# EAGLE design 009 (EAGLE 5.09)
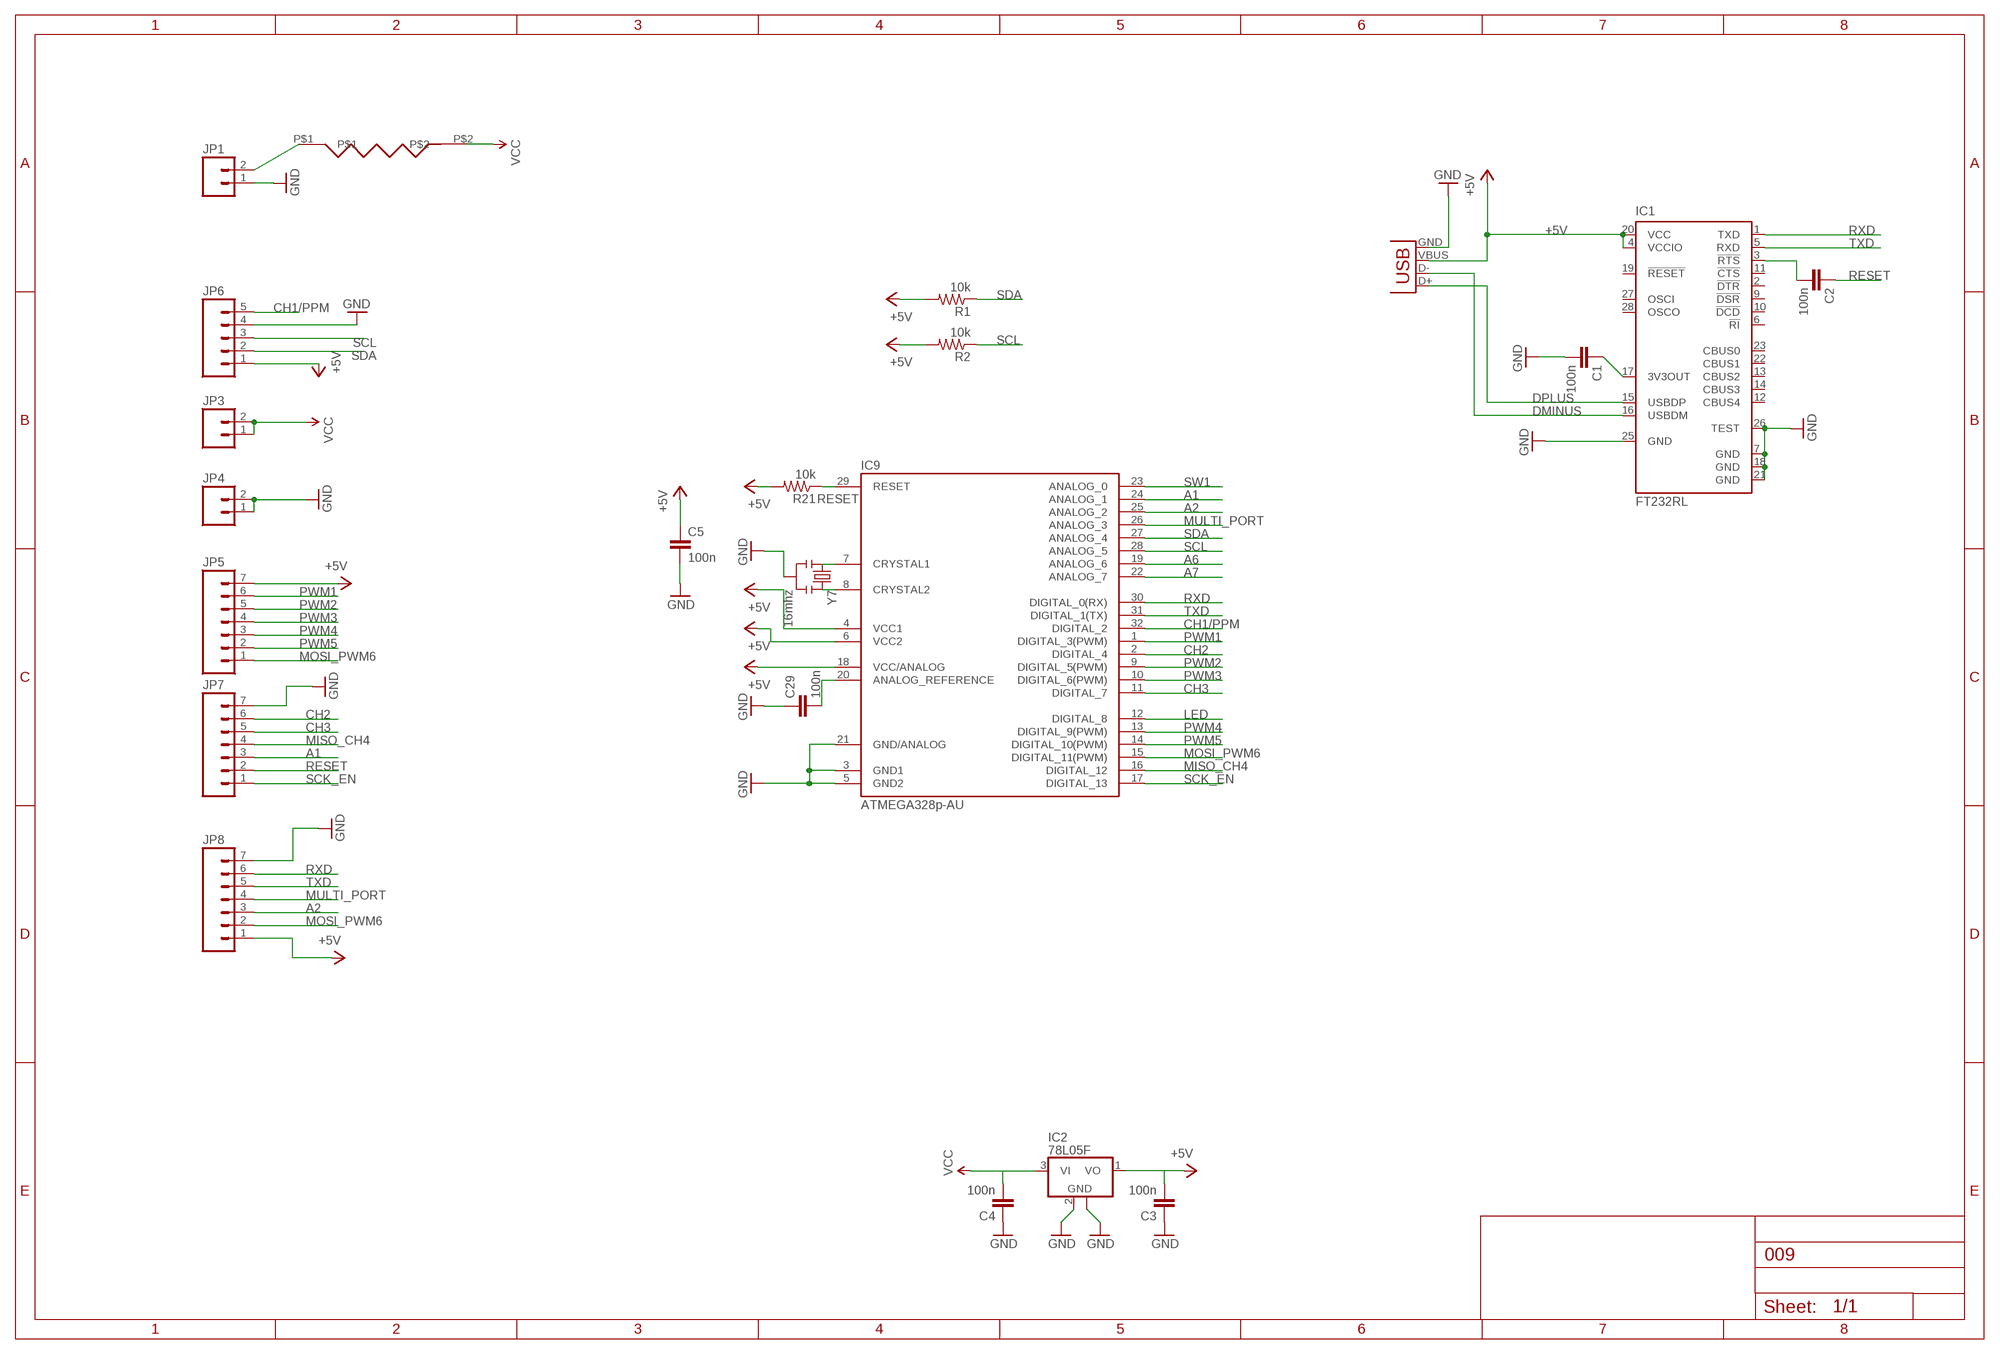
[diagram p0: schematic, sheet 1]

## Parts
C1  100n  CAP0805  [0805]
C2  100n  CAP0805  [0805]
C3  100n  CAP0805  [0805]
C4  100n  CAP0805  [0805]
C5  100n  CAP0805  [0805]
C29  100n  CAP0805  [0805]
IC1  FT232RL  [SSOP28]
IC2  78L05F  [SOT89]
IC9  ATMEGA328p-AU  ATMEGA168-AU  [TQFP32-08]
JP1  M02PTH  [1X02]
JP3  M02PTH  [1X02]
JP4  M02PTH  [1X02]
JP5  M07  [1X07]
JP6  M05PTH  [1X05]
JP7  M07  [1X07]
JP8  M07  [1X07]
R1  10k  RESISTOR0805-RES  [0805]
R2  10k  RESISTOR0805-RES  [0805]
R21  10k  RESISTOR0805-RES  [0805]
U$1  SMD_FUSE  [SMD_FUSE]
X2  USBOLD  [USB-MINIB-OLD]
Y7  16mhz  RESONATORSMD  [RESONATOR-SMD]

## Nets
+5V: C3.2 C5.1 IC1.4(VCCIO) IC1.20(VCC) IC2.1(VO) IC9.4(VCC1) IC9.6(VCC2) IC9.18(VCC/ANALOG) JP5.7 JP6.1 JP8.1 R1.2 R2.2 R21.2 X2.VBUS
A1: IC9.24(ANALOG_1) JP7.3
A2: IC9.25(ANALOG_2) JP8.3
A6: IC9.19(ANALOG_6)
A7: IC9.22(ANALOG_7)
CH1/PPM: IC9.32(DIGITAL_2) JP6.5
CH2: IC9.2(DIGITAL_4) JP7.6
CH3: IC9.11(DIGITAL_7) JP7.5
DMINUS: IC1.16(USBDM) X2.D-
DPLUS: IC1.15(USBDP) X2.D+
GND: C1.2 C3.1 C4.1 C5.2 C29.1 IC1.7(GND) IC1.18(GND) IC1.21(GND) IC1.25(GND) IC1.26(TEST) IC2.2(GND) IC2.2@1(GND) IC9.3(GND1) IC9.5(GND2) IC9.21(GND/ANALOG) JP1.1 JP4.1 JP4.2 JP6.4 JP7.7 JP8.7 X2.GND Y7.2
LED: IC9.12(DIGITAL_8)
MISO_CH4: IC9.16(DIGITAL_12) JP7.4
MOSI_PWM6: IC9.15(DIGITAL_11(PWM)) JP5.1 JP8.2
MULTI_PORT: IC9.26(ANALOG_3) JP8.4
N$1: JP1.2 U$1.P$1
N$22: C1.1 IC1.17(3V3OUT)
N$26: C2.2 IC1.3(!RTS)
N$38: IC9.8(CRYSTAL2) Y7.3
N$39: IC9.7(CRYSTAL1) Y7.1
N$40: C29.2 IC9.20(ANALOG_REFERENCE)
PWM1: IC9.1(DIGITAL_3(PWM)) JP5.6
PWM2: IC9.9(DIGITAL_5(PWM)) JP5.5
PWM3: IC9.10(DIGITAL_6(PWM)) JP5.4
PWM4: IC9.13(DIGITAL_9(PWM)) JP5.3
PWM5: IC9.14(DIGITAL_10(PWM)) JP5.2
RESET: C2.1 IC9.29(RESET) JP7.2 R21.1
RXD: IC1.1(TXD) IC9.30(DIGITAL_0(RX)) JP8.6
SCK_EN: IC9.17(DIGITAL_13) JP7.1
SCL: IC9.28(ANALOG_5) JP6.3 R2.1
SDA: IC9.27(ANALOG_4) JP6.2 R1.1
SW1: IC9.23(ANALOG_0)
TXD: IC1.5(RXD) IC9.31(DIGITAL_1(TX)) JP8.5
VCC: C4.2 IC2.3(VI) JP3.1 JP3.2 U$1.P$2
Unconnected: IC1.2(!DTR) IC1.6(!RI) IC1.9(!DSR) IC1.10(!DCD) IC1.11(!CTS) IC1.12(CBUS4) IC1.13(CBUS2) IC1.14(CBUS3) IC1.19(!RESET) IC1.22(CBUS1) IC1.23(CBUS0) IC1.27(OSCI) IC1.28(OSCO)

## Notes on the sheet
- FTDI

## Library data of the parts
C1-C5 C29 = SparkFun:CAP: Capacitor Standard 0603 ceramic capacitor, and 0.1" leaded capacitor.
IC1 = ftdichip:FT232R: Source: http://www.ftdichip.com/Documents/DataSheets/DS_FT232R_v104.pdf
IC2 = linear:78L*: POSITOIV-VOLTAGE REGULATORS Output up to 100 mA Source: http://focus.ti.com/lit/ds/symlink/ua78l05.pdf
IC9 = Arduino-AVR:ATMEGA168
JP1 JP3 JP4 = SparkFun:M02: Header 2 Standard 2-pin 0.1" header. Use with straight break away headers (SKU : PRT-00116), right angle break away headers (PRT-00553), swiss pins (PRT-00743), machine pins (PRT-00117), and female headers (PRT-00115). Molex polarized connector foot print use with SKU : PRT-08233 with associated crimp pins and housings.
JP5 JP7 JP8 = SparkFun:M07: Header 7 Standard 7-pin 0.1" header. Use with straight break away headers (SKU : PRT-00116), right angle break away headers (PRT-00553), swiss pins (PRT-00743), machine pins (PRT-00117), and female headers (PRT-00115). NOTES ON THE VARIANTS LOCK and LOCK_LONGPADS... This footprint was designed to help hold the alignment of a through-hole component (i.e. 7-pin header) while soldering it into place. You may notice that each hole has been shifted either up or down by 0.005 of an inch from it's more standard position (which is usually a perfectly straight line). This slight alteration caused the pins (the squares in the middle) to touch the edges of the holes. Because they are alternating, it causes a "brace" to hold the header in place. 0.005 has proven to be the perfect amount of "off-center" position when using our standard breakaway headers. Although looks a little odd when you look at the bare footprint, once you have a header in there, the alteration is very hard to notice. Also, if you push a header all the way into place, it is covered up entirely on the bottom side. This idea of altering the position of holes to aid alignment will be further integrated into the Sparkfun Library for other footprints. It can help hold any component with 3 or more connection pins.
JP6 = SparkFun:M05: Header 5 Standard 5-pin 0.1" header. Use with straight break away headers (SKU : PRT-00116), right angle break away headers (PRT-00553), swiss pins (PRT-00743), machine pins (PRT-00117), and female headers (PRT-00115). Molex polarized connector foot print use with SKU : PRT-08230 with associated crimp pins and housings.
R1 R2 R21 = SparkFun:RESISTOR: Resistor Basic schematic elements and footprints for 0603, 1206, and PTH resistors.
U$1 = SMD_FUSE:SMD_FUSE
X2 = SparkFun:USB: USB Connectors USB-B-PTH is fully proven SKU : PRT-00139 USB-miniB is fully proven SKU : PRT-00587 USB-A-PCB is untested. USB-A-H is throughly reviewed, but untested. Spark Fun Electronics SKU : PRT-00437 USB-B-SMT is throughly reviewed, but untested. Needs silkscreen touching up. USB-A-S has not been used/tested USB-MB-H has not been used/tested
Y7 = SparkFun:RESONATOR: Resonator Small SMD resonator. This is the itty bitty 10/20MHz resonators with built in caps. CSTCE10M0G55 and CSTCE20M0V53. Footprint has been reviewed closely but hasn't been tested yet.

## Net classes
0 default: width 0.152 mm, clearance 0.152 mm

## Board
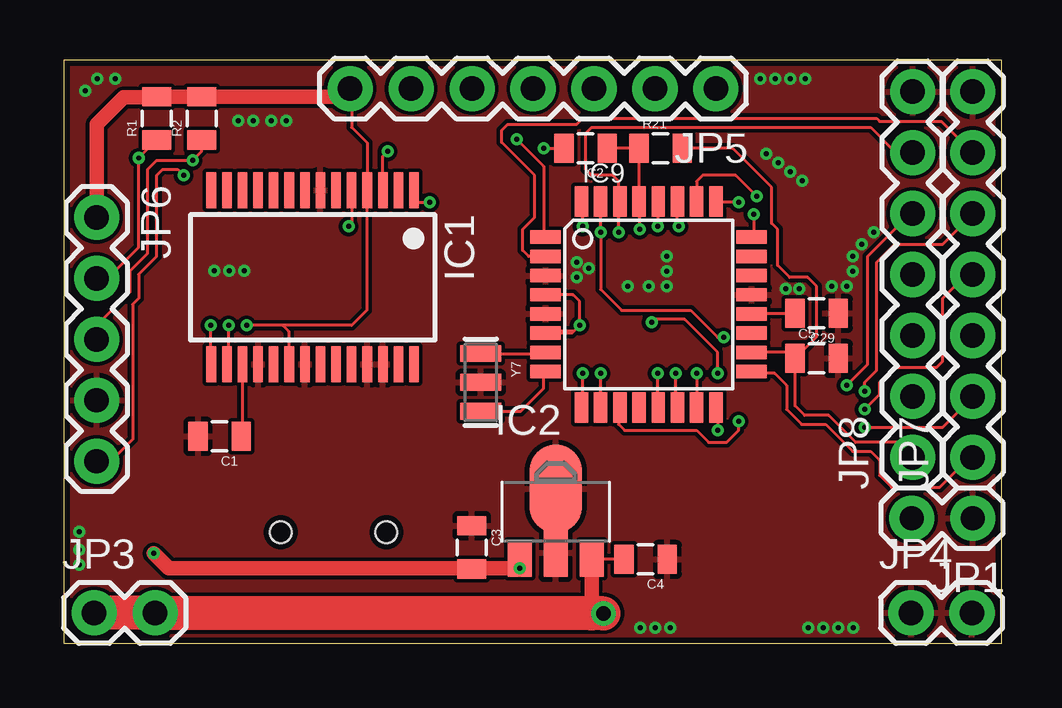
[diagram p1: board, top side]
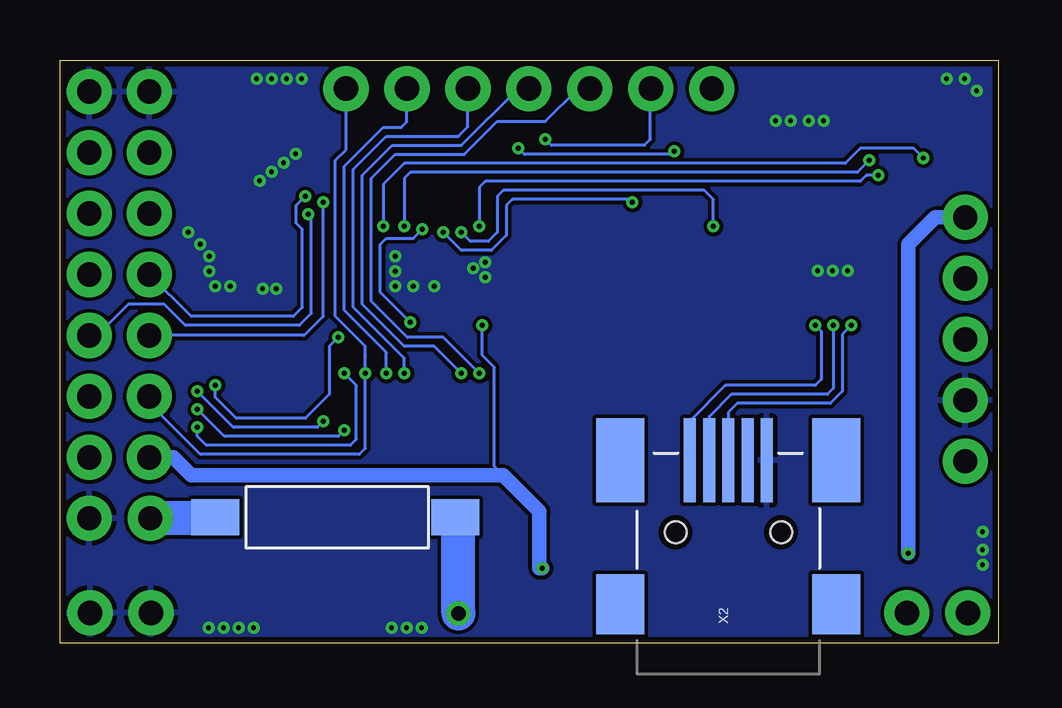
[diagram p2: board, bottom side, seen from below]

Size 39.1 x 24.31 mm. Coordinates in mm from the lower left corner, seen from the top.
Outline: 0,0 39.1,0 39.1,24.31 0,24.31 0,0
Copper layers (1*16): Top 0.035mm / dielectric 1.5mm / Bottom 0.035mm
Design rules "mydefaults": minimum track width 6mil, minimum drill 12mil, track to track 6mil, track to pad 6mil, pad to pad 6mil, via to via 6mil, smd to smd 0mil, copper to edge 10mil, drill to drill 8mil, minimum pad ring 8mil, minimum via ring 6mil, stop-mask expansion 2mil, vias tented up to drill 40mil, thermal gap 8mil

### Footprints (pad centres in the part's own frame; a part is rotated, then mirrored left to right if it is on the bottom)
0805 = smd 0.8 x 1.2: 1 -0.9,0; 2 0.9,0
SSOP28 = smd 0.4 x 1.5: 1 -4.225,-3.625; 2 -3.575,-3.625; 3 -2.925,-3.625; 4 -2.275,-3.625; 5 -1.625,-3.625; 6 -0.975,-3.625; 7 -0.325,-3.625; 8 0.325,-3.625; 9 0.975,-3.625; 10 1.625,-3.625; 11 2.275,-3.625; 12 2.925,-3.625; 13 3.575,-3.625; 14 4.225,-3.625; 15 4.225,3.625; 16 3.575,3.625; 17 2.925,3.625; 18 2.275,3.625; 19 1.625,3.625; 20 0.975,3.625; 21 0.325,3.625; 22 -0.325,3.625; 23 -0.975,3.625; 24 -1.625,3.625; 25 -2.275,3.625; 26 -2.925,3.625; 27 -3.575,3.625; 28 -4.225,3.625
SOT89 = smd 1 x 1.5: 1 -1.499,-1.981; 3 1.499,-1.981 | smd 1 x 2: 2 0,-1.727 | smd 2.2 x 3.7: 2@1 0,0.94
TQFP32-08 = smd 1.27 x 0.559: 1 -4.293,2.8; 2 -4.293,2; 3 -4.293,1.2; 4 -4.293,0.4; 5 -4.293,-0.4; 6 -4.293,-1.2; 7 -4.293,-2; 8 -4.293,-2.8; 17 4.293,-2.8; 18 4.293,-2; 19 4.293,-1.2; 20 4.293,-0.4; 21 4.293,0.4; 22 4.293,1.2; 23 4.293,2; 24 4.293,2.8 | smd 0.559 x 1.27: 9 -2.8,-4.293; 10 -2,-4.293; 11 -1.2,-4.293; 12 -0.4,-4.293; 13 0.4,-4.293; 14 1.2,-4.293; 15 2,-4.293; 16 2.8,-4.293; 25 2.8,4.293; 26 2,4.293; 27 1.2,4.293; 28 0.4,4.293; 29 -0.4,4.293; 30 -1.2,4.293; 31 -2,4.293; 32 -2.8,4.293
1X02 = drill 1.016 pad 1.88 round: 1 0,0; 2 2.54,0
1X07 = drill 1.016 pad 1.88 round: 1 0,0; 2 2.54,0; 3 5.08,0; 4 7.62,0; 5 10.16,0; 6 12.7,0; 7 15.24,0
1X05 = drill 1.016 pad 1.88 round: 1 0,0; 2 2.54,0; 3 5.08,0; 4 7.62,0; 5 10.16,0
SMD_FUSE = smd 2 x 1.5: P$1 0,0; P$2 10,0
USB-MINIB-OLD = smd 2.5 x 2: 1 -3,-4.5; 2 -3,4.5 | smd 3.5 x 2: 3 3,-4.5; 4 3,4.5 | smd 3.5 x 0.5: D+ 3,0; D- 3,0.8; GND 3,-1.6; ID 3,-0.8; VBUS 3.01,1.61 | hole 0.9: 0,2.2; 0,-2.2
RESONATOR-SMD = smd 0.7 x 1.7: 1 -1.2,0; 2 0,0; 3 1.2,0

### Placement (x,y rotation side)
C1  6.5,8.62 180 top
C2  21.75,20.62 180 top
C3  17,4 270 top
C4  24.25,3.5 180 top
C5  31.38,11.88 0 top
C29  31.38,13.75 180 top
IC1  10.38,15.25 180 top
IC2  20.5,5.5 0 top
IC9  24.38,14.12 0 top
JP1  37.88,5.21 180 top
JP3  1.27,1.27 0 top
JP4  35.31,1.27 0 top
JP5  27.18,23.11 180 top
JP6  1.38,17.75 270 top
JP7  37.88,7.75 90 top
JP8  35.38,7.75 90 top
R1  3.88,21.88 90 top
R2  5.75,21.88 90 top
R21  24.88,20.62 0 top
U$1  32.62,5.25 0 bottom
X2  11.25,4.62 90 bottom
Y7  17.38,10.88 270 top

### Tracks (layer width: path | path; a pad name or v marks a point on that pad's centre or on a via)
+5V  (via drill 0.2, 0.2 pad 0.12)
  Top 0.125: IC2.1 18.98,3.5 | 9.12,13.25 v7.62,13.25 | 9.12,13.25 9.38,13 9.38,11.65 IC1.20 | 9.12,13.25 12,13.25 12.62,13.88 12.62,18.85 IC1.4 12.65,20.85 12,21.5 12,23.05 JP5.7 | IC9.18 30.23,12.12 C5.1 | C5.1 30.48,9.9 30.88,9.5 31.88,9.5 33,8.38 34.75,8.38 JP8.1 | IC9.4 21.23,14.53 21.5,14.25 v21.5,13.25 21.25,13 | 21.25,13 20.16,13 IC9.6 21.18,12.93 21.25,13 | R21.2 27.88,20.62 29.5,19 29.5,17.5 29.75,17.25 29.75,15.75 30.25,15.25 31,15.25 31.38,14.88 31.38,12.78 C5.1
  Top 0.61: JP6.1 1.38,21.62 2.5,22.75 3.85,22.75 R2.2 R1.2 11.6,22.77 JP5.7 | 18.98,3.5 18.98,3.23 18.88,3.12 18.75,3.12 | 17.02,3.12 18.75,3.12 | 17.02,3.12 C3.2 | 18.75,3.12 19,3.38 IC2.1 v19,3.12 | 17.02,3.12 4.38,3.12 v3.75,3.75
  Bottom 0.125: X2.VBUS 12.86,9.27 11.38,10.75 7.62,10.75 7.38,11 7.38,13 v7.62,13.25 | v21.5,13.25 21.5,12 21,11.5 21,7.38 20.62,7
  Bottom 0.61: v3.75,3.75 3.75,16.62 2.62,17.75 JP6.1 | JP8.1 34.38,7.75 33.62,7 20.62,7 19.12,5.5 19.12,3.12 v19,3.12
A1  (via drill 0.2 pad 0.12)
  Top 0.125: v28.75,17.88 28.75,17.01 IC9.24
  Bottom 0.125: JP7.3 37.55,12.83 36.25,14.12 34.75,14.12 33.88,13.25 29.12,13.25 28.62,13.75 28.62,17.75 v28.75,17.88
A2  (via drill 0.2 pad 0.12)
  Top 0.125: v28.12,18.38 27.22,18.38 IC9.25
  Bottom 0.125: JP8.3 28.92,12.83 28.12,13.62 v28.12,18.38
CH1/PPM  (via drill 0.2)
  Top 0.125: JP6.5 1.96,7.59 2.88,8.5 2.88,14.12 3.12,14.38 3.12,15.38 3.88,16.12 3.88,19.5 4.12,19.75 4.75,19.75 v5,19.5 | v21.62,17.38 21.62,18.37 IC9.32
  Bottom 0.125: v5,19.5 5.5,19.5 5.75,19.25 21.38,19.25 21.62,19 v21.62,17.38
CH2
  Top 0.125: JP7.6 36.58,21.75 34,21.75 33.88,21.88 21.62,21.88 21.38,21.62 18.5,21.62 18.25,21.38 18.25,20.88 19.62,19.5 19.62,17.75 19.12,17.25 19.12,16.38 19.38,16.12 IC9.2
CH3  (via drill 0.2 pad 0.12)
  Top 0.125: JP7.5 37.88,17.88 36.62,16.62 34.62,16.62 33.88,15.88 33.88,11.38 33.38,10.88 v33.38,10.5 | v28.12,9.25 28.12,8.88 27.62,8.38 26.88,8.38 26.38,8.88 23.38,8.88 23.12,9.12 23.12,9.78 IC9.11
  Bottom 0.125: v33.38,10.5 31.88,9 28.38,9 v28.12,9.25
DMINUS  (via drill 0.2)
  Top 0.125: v6.88,13.25 6.88,11.7 IC1.16
  Bottom 0.125: X2.D- 12.05,9.45 11.12,10.38 7.12,10.38 6.88,10.62 v6.88,13.25
DPLUS  (via drill 0.2)
  Top 0.125: 6.12,11.6 IC1.15 6.12,11.65 v6.12,13.25
  Bottom 0.125: X2.D+ 11.25,9.62 10.88,10 7,10 6.5,10.5 6.5,12.88 v6.12,13.25
GND  (via drill 0.2 pad 0.12)
  other vias: 32,14.88 24.38,14.88 21.38,15.25 30.08,14.78 30.66,14.78 32.62,14.88 32.88,15.5 32.88,16.12 33.25,16.62 33.75,17.12 21.38,15.88 21.88,15.62 25.12,14.88 25.12,15.5 25.12,16.12 23.5,14.88 32.91,0.65 32.28,0.65 31.66,0.65 31.03,0.65 24.03,0.65 24.66,0.65 25.28,0.65 0.66,3.28 0.66,3.9 0.66,4.65 0.91,23.03 1.41,23.53 2.16,23.53 7.28,21.78 7.91,21.78 8.66,21.78 9.28,21.78 6.28,15.53 6.91,15.53 7.53,15.53 29.03,23.53 29.66,23.53 30.28,23.53 30.91,23.53 29.28,20.4 29.78,20.03 30.28,19.65 30.78,19.28
  pour Bottom: -0.06,24.36 39.15,24.37 39.16,-0.06 -0.06,-0.06
  pour Top: -0.06,24.36 39.15,24.37 39.16,-0.05 -0.06,-0.06
MISO_CH4  (via drill 0.2 pad 0.12)
  Top 0.125: JP7.4 37.62,15.37 36.62,14.38 36.62,11.75 36.38,11.5 34.62,11.5 34,10.88 34,10.38 v33.38,9.75 | v27.25,8.88 27.25,9.76 IC9.16
  Bottom 0.125: v33.38,9.75 32.25,8.62 27.5,8.62 v27.25,8.88
MOSI_PWM6  (via drill 0.2)
  Top 0.125: v26.38,11.25 IC9.15
  Bottom 0.125: JP5.1 27.18,20.57 27.62,20.12 27.62,13.62 26.38,12.38 26.38,12 v26.38,11.25 26.38,8.12 26.62,7.88 33.25,7.88 35.38,10 JP8.2
MULTI_PORT  (via drill 0.2 pad 0.12)
  Top 0.125: v28.88,18.62 28,19.5 26.62,19.5 26.38,19.25 IC9.26
  Bottom 0.125: JP8.4 33.62,13.62 29.38,13.62 29,14 29,17.25 29.25,17.5 29.25,18.25 v28.88,18.62
N$1
  Bottom 1.422: JP1.2 32.62,5.21 U$1.P$1
N$22
  Top 0.125: IC1.17 7.45,8.68 C1.1
N$26  (via drill 0.2)
  Top 0.125: IC1.3 13.3,20.3 v13.5,20.5 | v20,20.62 C2.2
  Bottom 0.125: v13.5,20.5 13.62,20.38 19.75,20.38 v20,20.62
N$38
  Top 0.125: Y7.3 19.05,9.68 20,10.62 20,11.24 IC9.8
N$39
  Top 0.125: Y7.1 20.03,12.07 IC9.7
N$40
  Top 0.125: C29.2 28.69,13.75 IC9.20
PWM1  (via drill 0.2 pad 0.12)
  Top 0.125: IC9.1 20,17.01 20,19.88 v18.88,21
  Bottom 0.125: v18.88,21 18.62,20.75 14.75,20.75 14.5,21 14.5,23.09 JP5.6
PWM2  (via drill 0.2 pad 0.12)
  Top 0.125: v21.62,11.25 21.62,9.88 IC9.9
  Bottom 0.125: v21.62,11.25 23.12,12.75 24.62,12.75 26.12,14.25 26.12,19.38 25.12,20.38 22.25,20.38 20.88,21.75 18.88,21.75 17.51,23.11 JP5.5
PWM3  (via drill 0.2)
  Top 0.125: IC9.10 v22.38,11.25
  Bottom 0.125: v22.38,11.25 23.5,12.38 24.75,12.38 26.5,14.12 26.5,19.5 25.25,20.75 22.38,20.75 20.01,23.11 JP5.4
PWM4  (via drill 0.2)
  Top 0.125: v24.75,11.25 24.75,9.86 IC9.13
  Bottom 0.125: JP5.3 22.1,21.53 22.5,21.12 25.5,21.12 26.88,19.75 26.88,14 24.75,11.88 v24.75,11.25
PWM5  (via drill 0.2)
  Top 0.125: v25.5,11.25 25.5,9.91 IC9.14
  Bottom 0.125: JP5.2 24.64,21.74 24.88,21.5 25.62,21.5 27.25,19.88 27.25,13.88 25.5,12.12 v25.5,11.25
RESET  (via drill 0.2 pad 0.12)
  Top 0.125: JP7.2 37.88,10.25 36.62,9 v33.38,9 | v27.25,11.25 27.25,12.12 25.88,13.5 24.62,13.5 v24.5,13.38 | v24,17.25 24,18.39 IC9.29 R21.1 C2.1
  Bottom 0.125: v33.38,9 33.38,8.62 33,8.25 27,8.25 26.75,8.5 26.75,10.75 v27.25,11.25 | v24.5,13.38 25.75,14.62 25.75,16.62 25.5,16.88 24.38,16.88 v24,17.25
RXD  (via drill 0.2)
  Top 0.125: v15.25,18.38 14.75,18.38 14.6,18.52 IC1.1 14.62,18.9 | v23.12,17.12 23.12,18.37 IC9.30 23.12,18.47 23.12,19.25 22.88,19.5 22,19.5 21.75,19.75 21.75,21.25 22,21.5 33.62,21.5 34.67,20.45 JP8.6
  Bottom 0.125: v15.25,18.38 15.38,18.5 20.25,18.5 20.5,18.25 20.5,17 21.12,16.38 22.38,16.38 v23.12,17.12
SCK_EN
  Top 0.125: JP7.1 37.75,7.75 36.5,6.5 34.5,6.5 34,7 34,7.62 33.62,8 32.88,8 31.75,9.12 30.75,9.12 30.12,9.75 30.12,10.75 29.62,11.25 28.74,11.25 IC9.17
SCL  (via drill 0.2)
  Top 0.125: JP6.3 1.38,13.25 2.75,14.62 2.75,15.5 3.5,16.25 3.5,19.75 3.88,20.12 v5.38,20.12 5.69,20.44 5.75,20.5 R2.1 | IC9.28 24.77,17.4 v24.75,17.38
  Bottom 0.125: v24.75,17.38 24.75,19.38 24.5,19.62 5.88,19.62 v5.38,20.12
SDA  (via drill 0.2)
  Top 0.125: JP6.2 1.83,15.21 3.12,16.5 v3.12,20.23 3.51,20.61 R1.1 | IC9.27 25.57,17.43 v25.62,17.38
  Bottom 0.125: v25.62,17.38 25.62,19.12 24.75,20 6.38,20 5.75,20.62 3.52,20.62 v3.12,20.23
TXD  (via drill 0.2, 0.2 pad 0.12)
  Top 0.125: IC1.5 12,17.5 v11.88,17.38 | IC9.31 v22.38,17.12 22.38,14.75 23.25,13.88 26.12,13.88 27.25,12.75 v27.5,12.75 | JP8.5 35.28,17.91 33.5,16.12 33.5,11.62 v32.62,10.75
  Bottom 0.125: v11.88,17.38 11.88,18.5 12.25,18.88 20.62,18.88 20.88,18.62 20.88,17.12 21.25,16.75 22,16.75 v22.38,17.12 | v32.62,10.75 32.62,10.25 31.75,9.38 28.88,9.38 27.88,10.38 27.88,12.38 v27.5,12.75
VCC  (via drill 0.6 pad 1.02)
  Top 0.125: IC2.3 23.33,3.52 C4.2
  Top 0.61: IC2.3 22,1.25
  Top 1.422: v22.5,1.25 22,1.25 3.81,1.25 JP3.2 JP3.1
  Bottom 1.422: U$1.P$2 22.5,5.25 v22.5,1.25